# Altium schematic sheet DSP-Core.SchDoc
size A3
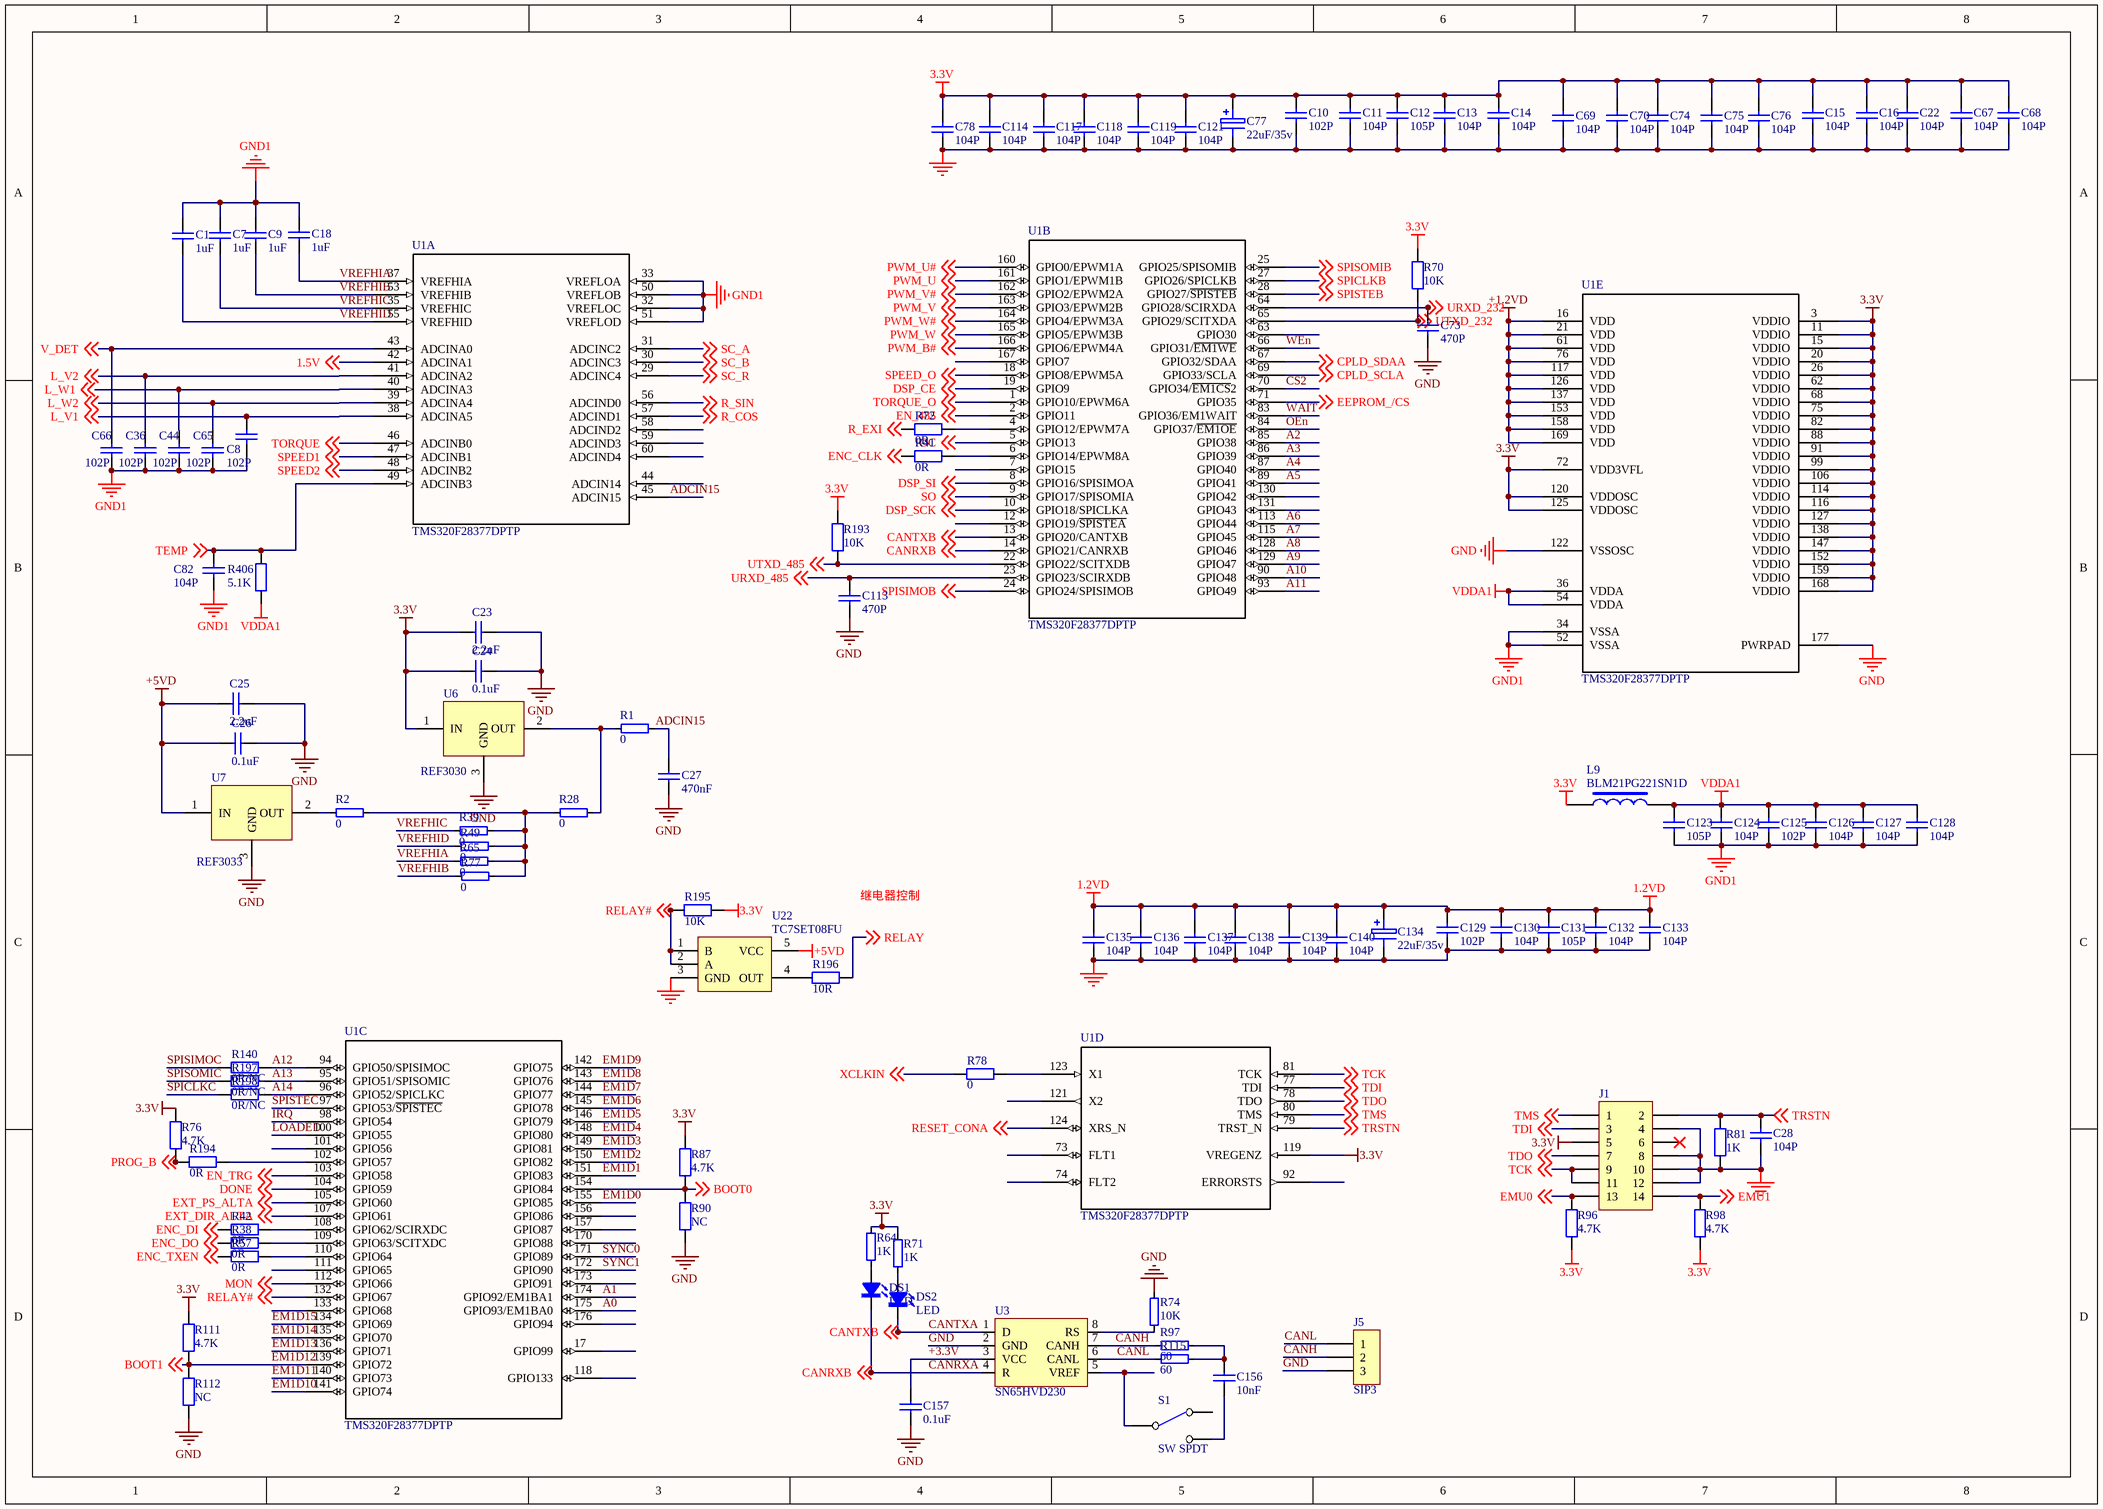
[diagram p0: DSP-Core.SchDoc]

## Parts
C1  1uF  [0805C]
C7  1uF  [0805C]
C8  102P  [0603C]
C9  1uF  [0805C]
C10  102P  [0603C]
C11  104P  [0603C]
C12  105P  [0603C]
C13  104P  [0603C]
C14  104P  [0603C]
C15  104P  [0603C]
C16  104P  [0603C]
C18  1uF  [0805C]
C22  104P  [0603C]
C23  2.2uF  [0603C]
C24  0.1uF  [0603C]
C25  2.2uF  [0603C]
C26  0.1uF  [0603C]
C27  470nF  [0603C]
C28  104P  [0603C]
C36  102P  [0603C]
C44  102P  [0603C]
C65  102P  [0603C]
C66  102P  [0603C]
C67  104P  [0603C]
C68  104P  [0603C]
C69  104P  [0603C]
C70  104P  [0603C]
C73  470P  [0603C]
C74  104P  [0603C]
C75  104P  [0603C]
C76  104P  [0603C]
C77  22uF/35v  [EC46]
C78  104P  [0603C]
C82  104P  [0603C]
C113  470P  [0603C]
C114  104P  [0603C]
C117  104P  [0603C]
C118  104P  [0603C]
C119  104P  [0603C]
C121  104P  [0603C]
C123  105P  [0603C]
C124  104P  [0603C]
C125  102P  [0603C]
C126  104P  [0603C]
C127  104P  [0603C]
C128  104P  [0603C]
C129  102P  [0603C]
C130  104P  [0603C]
C131  105P  [0603C]
C132  104P  [0603C]
C133  104P  [0603C]
C134  22uF/35v  [EC46]
C135  104P  [0603C]
C136  104P  [0603C]
C137  104P  [0603C]
C138  104P  [0603C]
C139  104P  [0603C]
C140  104P  [0603C]
C156  10nF  [0805C]
C157  0.1uF  [0603C]
DS1  LED  [0603D]
DS2  LED  [0603D]
J1  (no value)  [HDR2X7]
J5  SIP3  [SIP3-2.54]
L9  BLM21PG221SN1D  [0805R]
R1  0  [0603R]
R2  0  [0603R]
R28  0  [0603R]
R38  0R  [0603R]
R39  0  [0603R]
R41  0R  [0603R]
R42  0R  [0603R]
R49  0  [0603R]
R57  0R  [0603R]
R64  1K  [0603R]
R65  0  [0603R]
R70  10K  [0603R]
R71  1K  [0603R]
R72  0R  [0603R]
R74  10K  [0603R]
R76  4.7K  [0603R]
R77  0  [0603R]
R78  0  [0603R]
R81  1K  [0603R]
R87  4.7K  [0603R]
R90  NC  [0603R]
R96  4.7K  [0603R]
R97  60  [0603R]
R98  4.7K  [0603R]
R111  4.7K  [0603R]
R112  NC  [0603R]
R115  60  [0603R]
R140  0R/NC  [0603R]
R193  10K  [0603R]
R194  0R  [0603R]
R195  10K  [0603R]
R196  10R  [0603R]
R197  0R/NC  [0603R]
R198  0R/NC  [0603R]
R406  5.1K  [0603R]
S1  SW SPDT  [SIP3-2.54]
U1  TMS320F28377DPTP  [PTP0176F_N]  (parts A,B,C,D,E of 5)
U3  SN65HVD230  [SOIC-8]
U6  REF3030  [SOT-23]
U7  REF3033  [SOT-23]
U22  TC7SET08FU  [SSOP5-P-0.65A]

## Nets
1.2VD: C129.1 C130.1 C131.1 C132.1 C133.1 C134.1 C135.2 C136.2 C137.2 C138.2 C139.2 C140.2
3.3V: C10.1 C11.1 C12.1 C13.1 C14.1 C15.2 C16.2 C22.2 C23.1 C24.1 C67.2 C68.2 C69.2 C70.2 C74.2 C75.2 C76.2 C77.1 C78.2 C114.2 C117.2 C118.2 C119.2 C121.2 J1.5 L9.2 R64.1 R70.2 R71.1 R76.1 R87.1 R96.1 R98.1 R111.1 R193.2 R195.2 U1.3(VDDIO) U1.11(VDDIO) U1.15(VDDIO) U1.20(VDDIO) U1.26(VDDIO) U1.62(VDDIO) U1.68(VDDIO) U1.72(VDD3VFL) U1.75(VDDIO) U1.82(VDDIO) U1.88(VDDIO) U1.91(VDDIO) U1.99(VDDIO) U1.106(VDDIO) U1.114(VDDIO) U1.116(VDDIO) U1.119(VREGENZ) U1.120(VDDOSC) U1.125(VDDOSC) U1.127(VDDIO) U1.138(VDDIO) U1.147(VDDIO) U1.152(VDDIO) U1.159(VDDIO) U1.168(VDDIO) U6.1(IN)
+1.2VD: U1.16(VDD) U1.21(VDD) U1.61(VDD) U1.76(VDD) U1.117(VDD) U1.126(VDD) U1.137(VDD) U1.153(VDD) U1.158(VDD) U1.169(VDD)
+5VD: C25.1 C26.1 U7.1(IN) U22.5(VCC)
GND: C10.2 C11.2 C12.2 C13.2 C14.2 C15.1 C16.1 C22.1 C23.2 C24.2 C25.2 C26.2 C27.1 C28.1 C67.1 C68.1 C69.1 C70.1 C73.2 C74.1 C75.1 C76.1 C77.2 C78.1 C113.2 C114.1 C117.1 C118.1 C119.1 C121.1 C129.2 C130.2 C131.2 C132.2 C133.2 C134.2 C135.1 C136.1 C137.1 C138.1 C139.1 C140.1 C157.2 J1.4 J1.8 J1.10 J1.12 J5.3 R74.2 R81.2 R90.2 R112.2 U1.122(VSSOSC) U1.177(PWRPAD) U3.2(GND) U6.3(GND) U7.3(GND) U22.3(GND)
GND1: C1.1 C7.1 C8.1 C9.1 C18.1 C36.1 C44.1 C65.1 C66.2 C82.2 C123.1 C124.1 C125.1 C126.1 C127.1 C128.1 U1.32(VREFLOC) U1.33(VREFLOA) U1.34(VSSA) U1.50(VREFLOB) U1.51(VREFLOD) U1.52(VSSA)
VDDA1: C123.2 C124.2 C125.2 C126.2 C127.2 C128.2 L9.1 R406.1 U1.36(VDDA) U1.54(VDDA)
1.5V: U1.42(ADCINA1) ; off-sheet 1.5V
+3.3V: C157.1 U3.3(VCC)
A0: U1.175(GPIO93/EM1BA0)
A1: U1.174(GPIO92/EM1BA1)
A2: U1.85(GPIO38)
A3: U1.86(GPIO39)
A4: U1.87(GPIO40)
A5: U1.89(GPIO41)
A6: U1.113(GPIO44)
A7: U1.115(GPIO45)
A8: U1.128(GPIO46)
A9: U1.129(GPIO47)
A10: U1.90(GPIO48)
A11: U1.93(GPIO49)
A12: R140.1 U1.94(GPIO50/SPISIMOC)
A13: R197.1 U1.95(GPIO51/SPISOMIC)
A14: R198.1 U1.96(GPIO52/SPICLKC)
ADCIN15: C27.2 R1.2 U1.45(ADCIN15)
BOOT0: R87.2 R90.1 U1.154(GPIO84) ; off-sheet BOOT0
CANH: J5.2 R97.1 U3.7(CANH)
CANL: J5.1 R115.1 U3.6(CANL)
CANRXA: DS1.2 U1.14(GPIO21/CANRXB) U3.4(R) ; off-sheet CANRXB  [also labelled CANRXB]
CANTXA: DS2.2 U1.13(GPIO20/CANTXB) U3.1(D) ; off-sheet CANTXB  [also labelled CANTXB]
CPLD_SCLA: U1.69(GPIO33/SCLA) ; off-sheet CPLD_SCLA
CPLD_SDAA: U1.67(GPIO32/SDAA) ; off-sheet CPLD_SDAA
CS2: U1.70(GPIO34/~{EM1CS}2)
DONE: U1.104(GPIO59) ; off-sheet DONE
DSP_CE: U1.19(GPIO9) ; off-sheet DSP_CE
DSP_SCK: U1.10(GPIO18/SPICLKA) ; off-sheet DSP_SCK
DSP_SI: U1.8(GPIO16/SPISIMOA) ; off-sheet DSP_SI
EEPROM_/CS: U1.71(GPIO35) ; off-sheet EEPROM_/CS
EM1D0: U1.155(GPIO85)
EM1D1: U1.151(GPIO83)
EM1D2: U1.150(GPIO82)
EM1D3: U1.149(GPIO81)
EM1D4: U1.148(GPIO80)
EM1D5: U1.146(GPIO79)
EM1D6: U1.145(GPIO78)
EM1D7: U1.144(GPIO77)
EM1D8: U1.143(GPIO76)
EM1D9: U1.142(GPIO75)
EM1D10: U1.141(GPIO74)
EM1D11: U1.140(GPIO73)
EM1D12: R111.2 R112.1 U1.139(GPIO72) ; off-sheet BOOT1  [also labelled BOOT1]
EM1D13: U1.136(GPIO71)
EM1D14: U1.135(GPIO70)
EM1D15: U1.134(GPIO69)
EMU0: J1.13 R96.2 ; off-sheet EMU0
EMU1: J1.14 R98.2 ; off-sheet EMU1
EN_485: U1.2(GPIO11) ; off-sheet EN_485
EN_TRG: U1.103(GPIO58) ; off-sheet EN_TRG
ENC_CLK: R41.2 ; off-sheet ENC_CLK
ENC_DI: R42.1 ; off-sheet ENC_DI
ENC_DO: R38.1 ; off-sheet ENC_DO
ENC_TXEN: R57.1 ; off-sheet ENC_TXEN
EXT_DIR_ALTA: U1.107(GPIO61) ; off-sheet EXT_DIR_ALTA
EXT_PS_ALTA: U1.105(GPIO60) ; off-sheet EXT_PS_ALTA
IRQ: U1.98(GPIO54)
L_V1: C8.2 U1.38(ADCINA5) ; off-sheet L_V1
L_V2: C36.2 U1.41(ADCINA2) ; off-sheet L_V2
L_W1: C44.2 U1.40(ADCINA3) ; off-sheet L_W1
L_W2: C65.2 U1.39(ADCINA4) ; off-sheet L_W2
LOADED: U1.100(GPIO55)
MON: U1.112(GPIO66) ; off-sheet MON
OC: U1.5(GPIO13) ; off-sheet OC
OEn: U1.84(GPIO37/~{EM1OE})
PROG_B: R76.2 R194.2 ; off-sheet PROG_B
PWM_B#: U1.166(GPIO6/EPWM4A) ; off-sheet PWM_B#
PWM_U: U1.161(GPIO1/EPWM1B) ; off-sheet PWM_U
PWM_U#: U1.160(GPIO0/EPWM1A) ; off-sheet PWM_U#
PWM_V: U1.163(GPIO3/EPWM2B) ; off-sheet PWM_V
PWM_V#: U1.162(GPIO2/EPWM2A) ; off-sheet PWM_V#
PWM_W: U1.165(GPIO5/EPWM3B) ; off-sheet PWM_W
PWM_W#: U1.164(GPIO4/EPWM3A) ; off-sheet PWM_W#
R_COS: U1.57(ADCIND1) ; off-sheet R_COS
R_EXI: R72.2 ; off-sheet R_EXI
R_SIN: U1.56(ADCIND0) ; off-sheet R_SIN
RELAY: R196.1 ; off-sheet RELAY
RELAY#: R195.1 U1.132(GPIO67) U22.1(B) U22.2(A) ; off-sheet RELAY#
RESET_CONA: U1.124(XRS_N) ; off-sheet RESET_CONA
SC_A: U1.31(ADCINC2) ; off-sheet SC_A
SC_B: U1.30(ADCINC3) ; off-sheet SC_B
SC_R: U1.29(ADCINC4) ; off-sheet SC_R
SO: U1.9(GPIO17/SPISOMIA) ; off-sheet SO
SPEED1: U1.47(ADCINB1) ; off-sheet SPEED1
SPEED2: U1.48(ADCINB2) ; off-sheet SPEED2
SPEED_O: U1.18(GPIO8/EPWM5A) ; off-sheet SPEED_O
SPICLKB: U1.27(GPIO26/SPICLKB) ; off-sheet SPICLKB
SPICLKC: R198.2
SPISIMOB: U1.24(GPIO24/SPISIMOB) ; off-sheet SPISIMOB
SPISIMOC: R140.2
SPISOMIB: U1.25(GPIO25/SPISOMIB) ; off-sheet SPISOMIB
SPISOMIC: R197.2
SPISTEB: U1.28(GPIO27/~{SPISTEB}) ; off-sheet SPISTEB
SPISTEC: U1.97(GPIO53/~{SPISTEC})
SYNC0: U1.171(GPIO89)
SYNC1: U1.172(GPIO90)
TCK: J1.9 J1.11 U1.81(TCK) ; off-sheet TCK
TDI: J1.3 U1.77(TDI) ; off-sheet TDI
TDO: J1.7 U1.78(TDO) ; off-sheet TDO
TEMP: C82.1 R406.2 U1.49(ADCINB3) ; off-sheet TEMP
TMS: J1.1 U1.80(TMS) ; off-sheet TMS
TORQUE: U1.46(ADCINB0) ; off-sheet TORQUE
TORQUE_O: U1.1(GPIO10/EPWM6A) ; off-sheet TORQUE_O
TRSTN: C28.2 J1.2 R81.1 U1.79(TRST_N) ; off-sheet TRSTN
URXD_232: C73.1 U1.64(GPIO28/SCIRXDA) ; off-sheet URXD_232
URXD_485: C113.1 U1.23(GPIO23/SCIRXDB) ; off-sheet URXD_485
UTXD_232: R70.1 U1.65(GPIO29/SCITXDA) ; off-sheet UTXD_232
UTXD_485: R193.1 U1.22(GPIO22/SCITXDB) ; off-sheet UTXD_485
V_DET: C66.1 U1.43(ADCINA0) ; off-sheet V_DET
VREFHIA: C18.2 R65.1 U1.37(VREFHIA)
VREFHIB: C9.2 R77.1 U1.53(VREFHIB)
VREFHIC: C7.2 R39.1 U1.35(VREFHIC)
VREFHID: C1.2 R49.1 U1.55(VREFHID)
WAIT: U1.83(GPIO36/EM1WAIT)
WEn: U1.66(GPIO31/~{EM1WE})
XCLKIN: R78.1 ; off-sheet XCLKIN
NetC156_1: C156.1 R97.2 R115.2
NetC156_2: C156.2 S1.3
NetDS1_1: DS1.1 R64.2
NetDS2_1: DS2.1 R71.2
NetR1_1: R1.1 R28.2 U6.2(OUT)
NetR2_1: R2.1 U7.2(OUT)
NetR2_2: R2.2 R28.1 R39.2 R49.2 R65.2 R77.2
NetR38_2: R38.2 U1.109(GPIO63/SCITXDC)
NetR41_1: R41.1 U1.6(GPIO14/EPWM8A)
NetR42_2: R42.2 U1.108(GPIO62/SCIRXDC)
NetR57_2: R57.2 U1.110(GPIO64)
NetR72_1: R72.1 U1.4(GPIO12/EPWM7A)
NetR74_1: R74.1 U3.8(RS)
NetR78_2: R78.2 U1.123(X1)
NetR194_1: R194.1 U1.102(GPIO57)
NetR196_2: R196.2 U22.4(OUT)
NetS1_2: S1.2 U3.5(VREF)

Not connected (* = marked no-connect by the designer): J1 6*; S1 1; U1 7(GPIO15) 12(GPIO19/~{SPISTEA}) 17(GPIO99) 44(ADCIN14) 58(ADCIND2) 59(ADCIND3) 60(ADCIND4) 63(GPIO30) 73(FLT1) 74(FLT2) 92(ERRORSTS) 101(GPIO56) 111(GPIO65) 118(GPIO133) 121(X2) 130(GPIO42) 131(GPIO43) 133(GPIO68) 156(GPIO86) 157(GPIO87) 167(GPIO7) 170(GPIO88) 173(GPIO91) 176(GPIO94)

## Notes on the sheet
- 继电器控制

## Library data of the parts
C1 C7 C9 C18 C23-C27 C156 C157 = CAP: SMD-CAP
C8 C10-C16 C22 C28 C36 C44 C65-C70 C73-C76 C78 C82 C113 C114 C117-C119 C121 C123-C133 C135-C140 = Cap: Capacitor; Value: 100pF; Published: 8-Jun-2000; LatestRevisionDate: 17-Jul-2002; LatestRevisionNote: Re-released for DXP Platform.; PackageReference: RAD-0.3; Publisher: Altium Limited
C77 C134 = ELECTRO1: Electrolytic Capacitor
J1 = Header 7X2: Header, 7-Pin, Dual row; LatestRevisionDate: 17-Jul-2002; LatestRevisionNote: Re-released for DXP Platform.; Publisher: Altium Limited
J5 = SIP3: jointbar
L9 = INDUCTOR2
R1 R2 R28 R39 R49 R64 R65 R71 R74 R77 R97 R115 = R-10K: resistor
R38 R41 R42 R57 R70 R72 R76 R78 R87 R90 R96 R98 R111 R112 R140 R193-R198 R406 = Res2: Resistor; Value: 1K; Published: 8-Jun-2000; LatestRevisionDate: 17-Jul-2002; LatestRevisionNote: Re-released for DXP Platform.; PackageReference: AXIAL-0.4; Publisher: Altium Limited
R81 = Res2: Resistor; Published: 8-Jun-2000; LatestRevisionDate: 17-Jul-2002; LatestRevisionNote: Re-released for DXP Platform.; PackageReference: AXIAL-0.4; Publisher: Altium Limited; Value: 1K
U1 = TMS320F28377DPTP: No Description Available; Manufacturer: Texas Instruments; CompType: IC; PIN_COUNT: 177; PartNumber: TMS320F28377DPTP; PackageReference: PTP0176F; MountType: SMT; RoHS: Y; RefDes: RefDes; Type: DEV; Value: Value; Copyright: Copyright (C) 2018 Accelerated Designs. All rights reserved
U3 = SN65HV230
U7 = REF3030